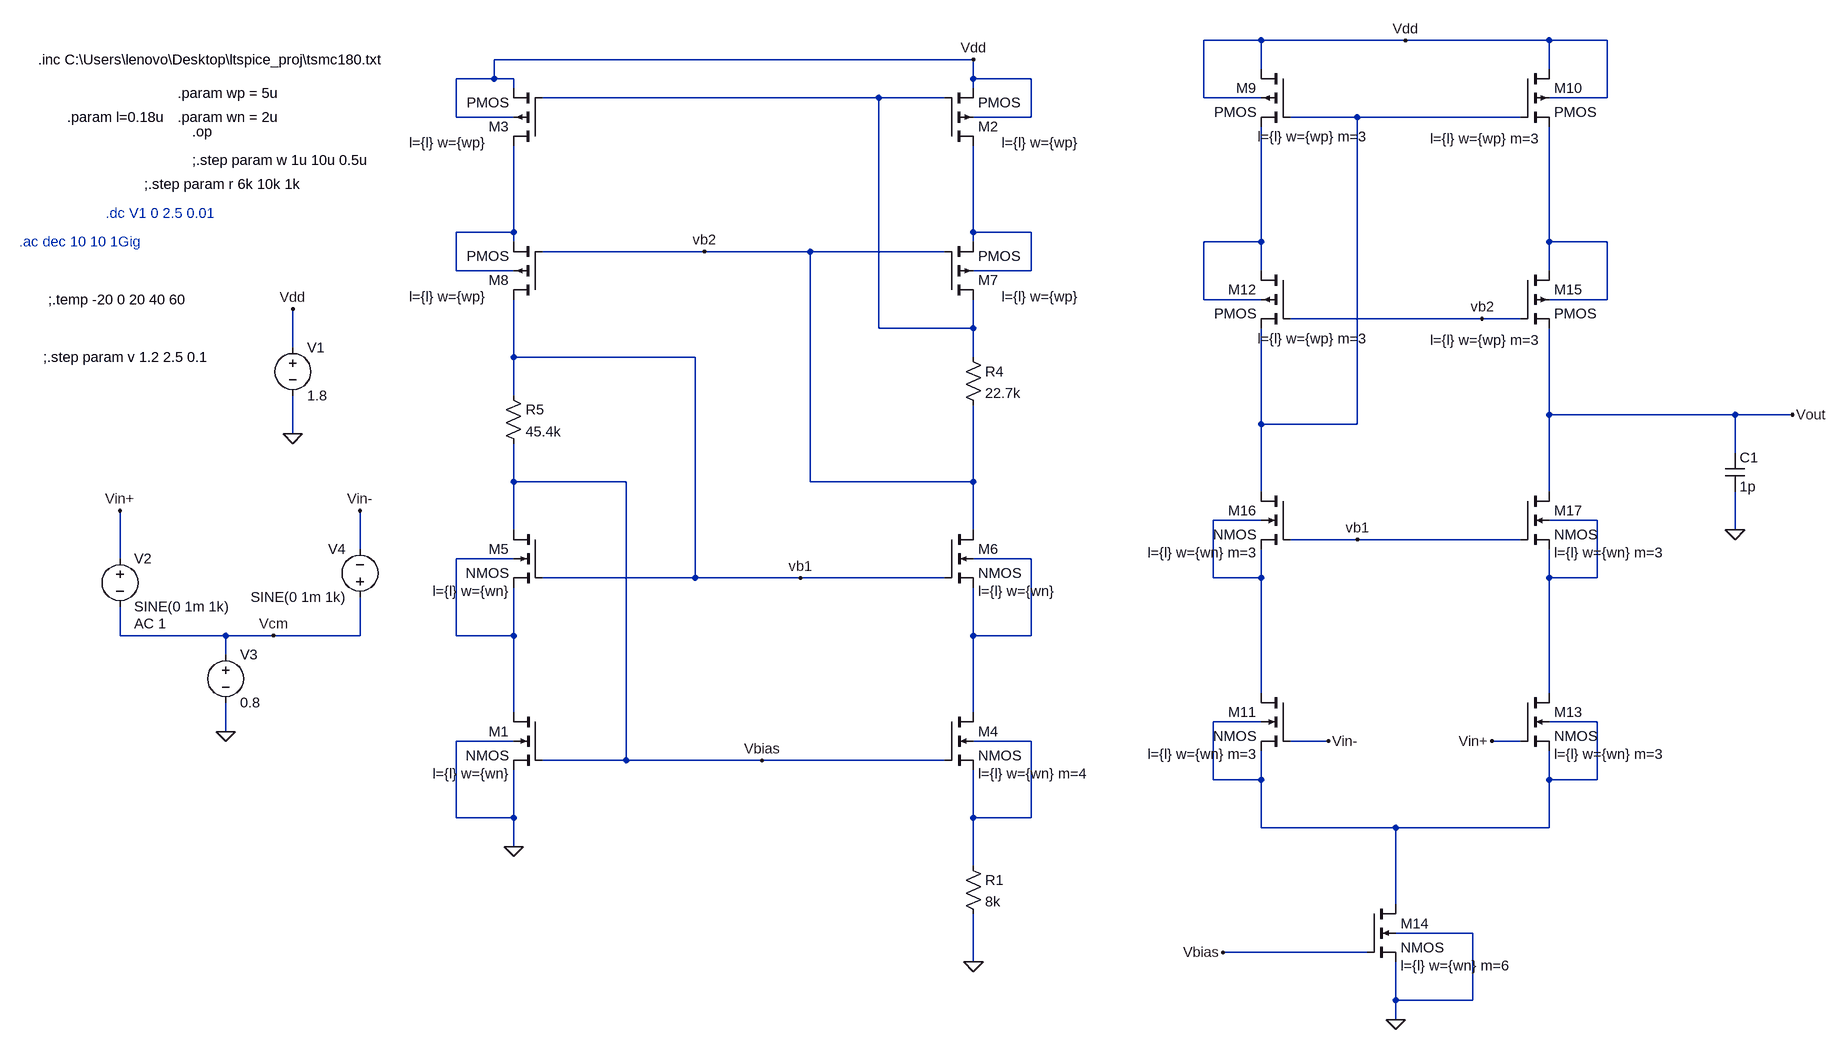
[diagram p0: schematic nmos-telescopic.asc]
nmos-telescopic.asc, the LTspice schematic file:
Version 4
SHEET 1 3404 2024
WIRE 1632 -160 1536 -160
WIRE 1872 -160 1632 -160
WIRE 2112 -160 1872 -160
WIRE 2208 -160 2112 -160
WIRE 752 -128 -288 -128
WIRE 1632 -112 1632 -160
WIRE 2112 -112 2112 -160
WIRE -288 -96 -288 -128
WIRE -288 -96 -352 -96
WIRE -256 -96 -288 -96
WIRE 752 -96 752 -128
WIRE 848 -96 752 -96
WIRE -256 -80 -256 -96
WIRE 752 -80 752 -96
WIRE 464 -64 -208 -64
WIRE 704 -64 464 -64
WIRE 1536 -64 1536 -160
WIRE 1632 -64 1536 -64
WIRE 2208 -64 2208 -160
WIRE 2208 -64 2112 -64
WIRE -352 -32 -352 -96
WIRE -256 -32 -352 -32
WIRE 848 -32 848 -96
WIRE 848 -32 752 -32
WIRE 1792 -32 1680 -32
WIRE 2064 -32 1792 -32
WIRE -256 160 -256 16
WIRE -256 160 -352 160
WIRE 752 160 752 16
WIRE 848 160 752 160
WIRE -256 176 -256 160
WIRE 752 176 752 160
WIRE 1632 176 1632 -16
WIRE 1632 176 1536 176
WIRE 2112 176 2112 -16
WIRE 2208 176 2112 176
WIRE 144 192 -208 192
WIRE 320 192 144 192
WIRE 704 192 320 192
WIRE -352 224 -352 160
WIRE -256 224 -352 224
WIRE 848 224 848 160
WIRE 848 224 752 224
WIRE 1632 224 1632 176
WIRE 2112 224 2112 176
WIRE 1536 272 1536 176
WIRE 1632 272 1536 272
WIRE 2208 272 2208 176
WIRE 2208 272 2112 272
WIRE 2000 304 1680 304
WIRE 2064 304 2000 304
WIRE 464 320 464 -64
WIRE 752 320 752 272
WIRE 752 320 464 320
WIRE -624 352 -624 288
WIRE -256 368 -256 272
WIRE 128 368 -256 368
WIRE 752 368 752 320
WIRE -256 432 -256 368
WIRE 2112 464 2112 320
WIRE 2448 464 2112 464
WIRE 2544 464 2448 464
WIRE 1632 480 1632 320
WIRE 1792 480 1792 -32
WIRE 1792 480 1632 480
WIRE -624 496 -624 432
WIRE 2448 528 2448 464
WIRE -256 576 -256 512
WIRE -48 576 -256 576
WIRE 320 576 320 192
WIRE 752 576 752 448
WIRE 752 576 320 576
WIRE 1632 592 1632 480
WIRE 2112 592 2112 464
WIRE 1632 640 1552 640
WIRE 2192 640 2112 640
WIRE -256 656 -256 576
WIRE 752 656 752 576
WIRE 2448 656 2448 592
WIRE 1792 672 1680 672
WIRE 2064 672 1792 672
WIRE -512 688 -512 624
WIRE -912 704 -912 624
WIRE -256 704 -352 704
WIRE 848 704 752 704
WIRE 128 736 128 368
WIRE 128 736 -208 736
WIRE 304 736 128 736
WIRE 704 736 304 736
WIRE 1552 736 1552 640
WIRE 1632 736 1632 688
WIRE 1632 736 1552 736
WIRE 2112 736 2112 688
WIRE 2192 736 2192 640
WIRE 2192 736 2112 736
WIRE -912 832 -912 784
WIRE -736 832 -912 832
WIRE -656 832 -736 832
WIRE -512 832 -512 768
WIRE -512 832 -656 832
WIRE -352 832 -352 704
WIRE -256 832 -256 752
WIRE -256 832 -352 832
WIRE 752 832 752 752
WIRE 848 832 848 704
WIRE 848 832 752 832
WIRE -736 864 -736 832
WIRE 1632 928 1632 736
WIRE 2112 928 2112 736
WIRE -256 960 -256 832
WIRE 752 960 752 832
WIRE 1632 976 1552 976
WIRE 2192 976 2112 976
WIRE -736 992 -736 944
WIRE -256 1008 -352 1008
WIRE 848 1008 752 1008
WIRE 1744 1008 1680 1008
WIRE 2064 1008 2016 1008
WIRE -48 1040 -48 576
WIRE -48 1040 -208 1040
WIRE 240 1040 -48 1040
WIRE 704 1040 240 1040
WIRE 1552 1072 1552 976
WIRE 1632 1072 1632 1024
WIRE 1632 1072 1552 1072
WIRE 2112 1072 2112 1024
WIRE 2192 1072 2192 976
WIRE 2192 1072 2112 1072
WIRE -352 1136 -352 1008
WIRE -256 1136 -256 1056
WIRE -256 1136 -352 1136
WIRE 752 1136 752 1056
WIRE 848 1136 848 1008
WIRE 848 1136 752 1136
WIRE 1632 1152 1632 1072
WIRE 1856 1152 1632 1152
WIRE 2112 1152 2112 1072
WIRE 2112 1152 1856 1152
WIRE -256 1184 -256 1136
WIRE 752 1216 752 1136
WIRE 1856 1280 1856 1152
WIRE 1984 1328 1856 1328
WIRE 1808 1360 1568 1360
WIRE 752 1376 752 1296
WIRE 1856 1440 1856 1376
WIRE 1984 1440 1984 1328
WIRE 1984 1440 1856 1440
WIRE 1856 1472 1856 1440
FLAG -624 496 0
FLAG -624 288 Vdd
FLAG 752 -128 Vdd
FLAG -256 1184 0
FLAG 752 1376 0
FLAG 1744 1008 Vin-
FLAG 2016 1008 Vin+
FLAG 1568 1360 Vbias
FLAG 240 1040 Vbias
FLAG 1872 -160 Vdd
FLAG -736 992 0
FLAG -912 624 Vin+
FLAG -656 832 Vcm
FLAG 2544 464 Vout
FLAG 2448 656 0
FLAG 1856 1472 0
FLAG 304 736 vb1
FLAG 144 192 vb2
FLAG 2000 304 vb2
FLAG 1792 672 vb1
FLAG -512 624 Vin-
DATAFLAG 752 1184 ""
DATAFLAG 592 1040 ""
DATAFLAG -16 -64 ""
DATAFLAG 2000 1152 ""
DATAFLAG 1680 1360 ""
DATAFLAG 1968 -160 ""
DATAFLAG 1888 -32 ""
DATAFLAG 592 736 ""
DATAFLAG -16 192 ""
DATAFLAG 1888 304 ""
DATAFLAG 1920 672 ""
DATAFLAG 2288 464 ""
SYMBOL pmos4 704 16 M180
WINDOW 123 95 5 Left 2
SYMATTR Value2 l={l} w={wp}
SYMATTR InstName M2
SYMBOL voltage -624 336 R0
SYMATTR InstName V1
SYMATTR Value 1.8
SYMBOL pmos4 -208 16 R180
WINDOW 123 95 5 Left 2
SYMATTR Value2 l={l} w={wp}
SYMATTR InstName M3
SYMBOL nmos4 -208 960 M0
WINDOW 123 56 102 Left 2
SYMATTR Value2 l={l} w={wn}
SYMATTR InstName M1
SYMBOL nmos4 704 960 R0
WINDOW 123 56 102 Left 2
SYMATTR Value2 l={l} w={wn} m=4
SYMATTR InstName M4
SYMBOL res 736 1200 R0
SYMATTR InstName R1
SYMATTR Value 8k
SYMBOL pmos4 1680 -112 M0
WINDOW 123 -127 113 Left 2
SYMATTR Value2 l={l} w={wp} m=3
SYMATTR InstName M9
SYMBOL pmos4 2064 -112 R0
WINDOW 123 -151 116 Left 2
SYMATTR Value2 l={l} w={wp} m=3
SYMATTR InstName M10
SYMBOL nmos4 1680 928 M0
WINDOW 123 56 102 Left 2
SYMATTR Value2 l={l} w={wn} m=3
SYMATTR InstName M11
SYMBOL nmos4 2064 928 R0
WINDOW 123 56 102 Left 2
SYMATTR Value2 l={l} w={wn} m=3
SYMATTR InstName M13
SYMBOL nmos4 1808 1280 R0
WINDOW 123 56 102 Left 2
SYMATTR Value2 l={l} w={wn} m=6
SYMATTR InstName M14
SYMBOL voltage -912 688 R0
WINDOW 123 24 124 Left 2
WINDOW 39 0 0 Left 0
SYMATTR Value2 AC 1
SYMATTR InstName V2
SYMATTR Value SINE(0 1m 1k)
SYMBOL voltage -736 848 R0
SYMATTR InstName V3
SYMATTR Value 0.8
SYMBOL voltage -512 784 R180
WINDOW 0 24 96 Left 2
WINDOW 3 24 16 Left 2
WINDOW 123 24 -12 Left 2
WINDOW 39 0 0 Left 0
SYMATTR InstName V4
SYMATTR Value SINE(0 1m 1k)
SYMBOL cap 2432 528 R0
SYMATTR InstName C1
SYMATTR Value 1p
SYMBOL nmos4 -208 656 M0
WINDOW 123 56 102 Left 2
SYMATTR Value2 l={l} w={wn}
SYMATTR InstName M5
SYMBOL nmos4 704 656 R0
WINDOW 123 56 102 Left 2
SYMATTR Value2 l={l} w={wn}
SYMATTR InstName M6
SYMBOL pmos4 704 272 M180
WINDOW 123 95 5 Left 2
SYMATTR Value2 l={l} w={wp}
SYMATTR InstName M7
SYMBOL pmos4 -208 272 R180
WINDOW 123 95 5 Left 2
SYMATTR Value2 l={l} w={wp}
SYMATTR InstName M8
SYMBOL res 736 352 R0
SYMATTR InstName R4
SYMATTR Value 22.7k
SYMBOL res -272 416 R0
SYMATTR InstName R5
SYMATTR Value 45.4k
SYMBOL pmos4 1680 224 M0
WINDOW 123 -127 113 Left 2
SYMATTR Value2 l={l} w={wp} m=3
SYMATTR InstName M12
SYMBOL pmos4 2064 224 R0
WINDOW 123 -151 116 Left 2
SYMATTR Value2 l={l} w={wp} m=3
SYMATTR InstName M15
SYMBOL nmos4 1680 592 M0
WINDOW 123 56 102 Left 2
SYMATTR Value2 l={l} w={wn} m=3
SYMATTR InstName M16
SYMBOL nmos4 2064 592 R0
WINDOW 123 56 102 Left 2
SYMATTR Value2 l={l} w={wn} m=3
SYMATTR InstName M17
TEXT -1048 -128 Left 2 !.inc C:\\Users\\lenovo\\Desktop\\ltspice_proj\\tsmc180.txt
TEXT -792 -8 Left 2 !.op
TEXT -792 40 Left 2 !;.step param w 1u 10u 0.5u
TEXT -872 80 Left 2 !;.step param r 6k 10k 1k
TEXT -936 128 Left 2 ;.dc V1 0 2.5 0.01
TEXT -1080 176 Left 2 ;.ac dec 10 10 1Gig
TEXT -1032 272 Left 2 !;.temp -20 0 20 40 60
TEXT -1040 368 Left 2 !;.step param v 1.2 2.5 0.1
TEXT -816 -72 Left 2 !.param wp = 5u
TEXT -816 -32 Left 2 !.param wn = 2u
TEXT -1000 -32 Left 2 !.param l=0.18u

The netlist it stands for:
* nmos-telescopic.asc
M2 N004 N001 Vdd Vdd PMOS l={l} w={wp}
V1 Vdd 0 1.8
M3 N003 N001 Vdd Vdd PMOS l={l} w={wp}
M1 N009 Vbias 0 0 NMOS l={l} w={wn}
M4 N010 Vbias N012 N012 NMOS l={l} w={wn} m=4
R1 N012 0 8k
M9 Vdd N002 N005 Vdd PMOS l={l} w={wp} m=3
M10 Vdd N002 N006 Vdd PMOS l={l} w={wp} m=3
M11 N007 Vin- N011 N011 NMOS l={l} w={wn} m=3
M13 N008 Vin+ N011 N011 NMOS l={l} w={wn} m=3
M14 N011 Vbias 0 0 NMOS l={l} w={wn} m=6
V2 Vin+ Vcm SINE(0 1m 1k) AC 1
V3 Vcm 0 0.8
V4 Vcm Vin- SINE(0 1m 1k)
C1 Vout 0 1p
M5 Vbias vb1 N009 N009 NMOS l={l} w={wn}
M6 vb2 vb1 N010 N010 NMOS l={l} w={wn}
M7 N001 vb2 N004 N004 PMOS l={l} w={wp}
M8 vb1 vb2 N003 N003 PMOS l={l} w={wp}
R4 N001 vb2 22.7k
R5 vb1 Vbias 45.4k
M12 N005 vb2 N002 N005 PMOS l={l} w={wp} m=3
M15 N006 vb2 Vout N006 PMOS l={l} w={wp} m=3
M16 N002 vb1 N007 N007 NMOS l={l} w={wn} m=3
M17 Vout vb1 N008 N008 NMOS l={l} w={wn} m=3
.model NMOS NMOS
.model PMOS PMOS
.lib standard.mos
.inc C:\Users\lenovo\Desktop\ltspice_proj\tsmc180.txt
.op
;.step param w 1u 10u 0.5u
;.step param r 6k 10k 1k
* .dc V1 0 2.5 0.01
* .ac dec 10 10 1Gig
;.temp -20 0 20 40 60
;.step param v 1.2 2.5 0.1
.param wp = 5u
.param wn = 2u
.param l=0.18u
.backanno
.end